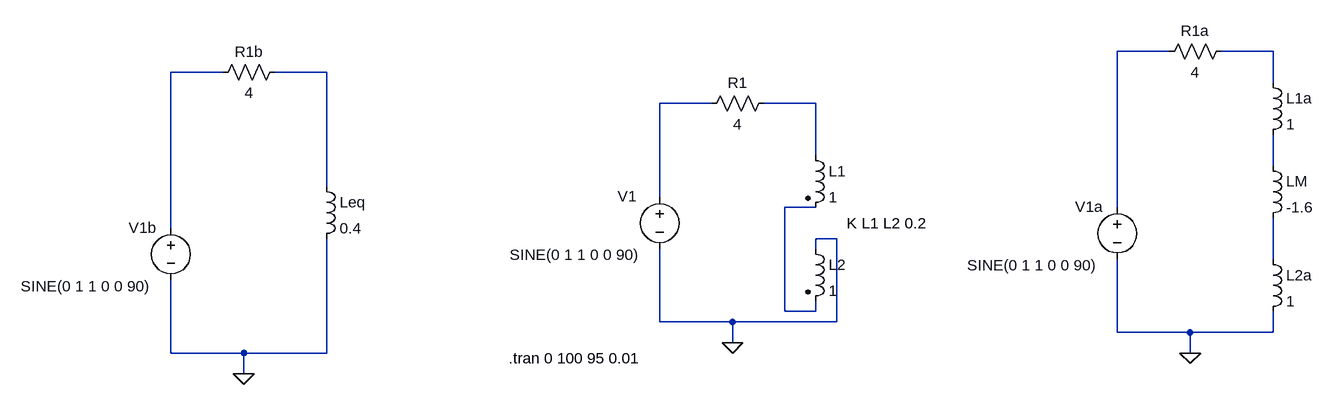
[diagram p0: schematic Induktivitate.asc]
Induktivitate.asc, the LTspice schematic file:
Version 4
SHEET 1 1156 680
WIRE 928 -112 848 -112
WIRE 1088 -112 1008 -112
WIRE -528 -80 -608 -80
WIRE -368 -80 -448 -80
WIRE 1088 -64 1088 -112
WIRE 224 -32 144 -32
WIRE 384 -32 304 -32
WIRE 384 48 384 -32
WIRE 1088 64 1088 16
WIRE -368 96 -368 -80
WIRE 144 112 144 -32
WIRE 384 128 336 128
WIRE 848 128 848 -112
WIRE -608 160 -608 -80
WIRE 416 176 384 176
WIRE 384 192 384 176
WIRE 1088 208 1088 144
WIRE 336 288 336 128
WIRE 384 288 384 272
WIRE 384 288 336 288
WIRE 144 304 144 192
WIRE 256 304 144 304
WIRE 416 304 416 176
WIRE 416 304 256 304
WIRE 848 320 848 208
WIRE 960 320 848 320
WIRE 1088 320 1088 288
WIRE 1088 320 960 320
WIRE 256 336 256 304
WIRE -608 352 -608 240
WIRE -496 352 -608 352
WIRE -368 352 -368 176
WIRE -368 352 -496 352
WIRE 960 352 960 320
WIRE -496 384 -496 352
FLAG 256 336 0
FLAG 960 352 0
FLAG -496 384 0
SYMBOL voltage 144 96 R0
WINDOW 0 -65 15 Left 2
WINDOW 3 -231 105 Left 2
WINDOW 123 0 0 Left 0
WINDOW 39 0 0 Left 0
SYMATTR InstName V1
SYMATTR Value SINE(0 1 1 0 0 90)
SYMBOL res 320 -48 R90
WINDOW 0 0 56 VBottom 2
WINDOW 3 32 56 VTop 2
SYMATTR InstName R1
SYMATTR Value 4
SYMBOL ind2 368 32 R0
SYMATTR InstName L1
SYMATTR Value 1
SYMATTR Type ind
SYMBOL ind2 368 176 R0
SYMATTR InstName L2
SYMATTR Value 1
SYMATTR Type ind
SYMBOL voltage 848 112 R0
WINDOW 0 -65 15 Left 2
WINDOW 3 -231 105 Left 2
WINDOW 123 0 0 Left 0
WINDOW 39 0 0 Left 0
SYMATTR InstName V1a
SYMATTR Value SINE(0 1 1 0 0 90)
SYMBOL res 1024 -128 R90
WINDOW 0 0 56 VBottom 2
WINDOW 3 32 56 VTop 2
SYMATTR InstName R1a
SYMATTR Value 4
SYMBOL ind 1072 48 R0
SYMATTR InstName LM
SYMATTR Value -1.6
SYMBOL ind 1072 192 R0
SYMATTR InstName L2a
SYMATTR Value 1
SYMBOL ind 1072 -80 R0
SYMATTR InstName L1a
SYMATTR Value 1
SYMBOL voltage -608 144 R0
WINDOW 0 -65 15 Left 2
WINDOW 3 -231 105 Left 2
WINDOW 123 0 0 Left 0
WINDOW 39 0 0 Left 0
SYMATTR InstName V1b
SYMATTR Value SINE(0 1 1 0 0 90)
SYMBOL res -432 -96 R90
WINDOW 0 0 56 VBottom 2
WINDOW 3 32 56 VTop 2
SYMATTR InstName R1b
SYMATTR Value 4
SYMBOL ind -384 80 R0
SYMATTR InstName Leq
SYMATTR Value 0.4
TEXT -88 360 Left 2 !.tran 0 100 95 0.01
TEXT 432 152 Left 2 !K L1 L2 0.2

The netlist it stands for:
* Induktivitate.asc
V1 N005 0 SINE(0 1 1 0 0 90)
R1 N006 N005 4
L1 N006 N008 1
L2 0 N008 1
V1a N001 0 SINE(0 1 1 0 0 90)
R1a N002 N001 4
LM N007 N009 -1.6
L2a N009 0 1
L1a N002 N007 1
V1b N003 0 SINE(0 1 1 0 0 90)
R1b N004 N003 4
Leq N004 0 0.4
.tran 0 100 95 0.01
K L1 L2 0.2
.backanno
.end